# EAGLE design Body-Shield (EAGLE 7.3.0)
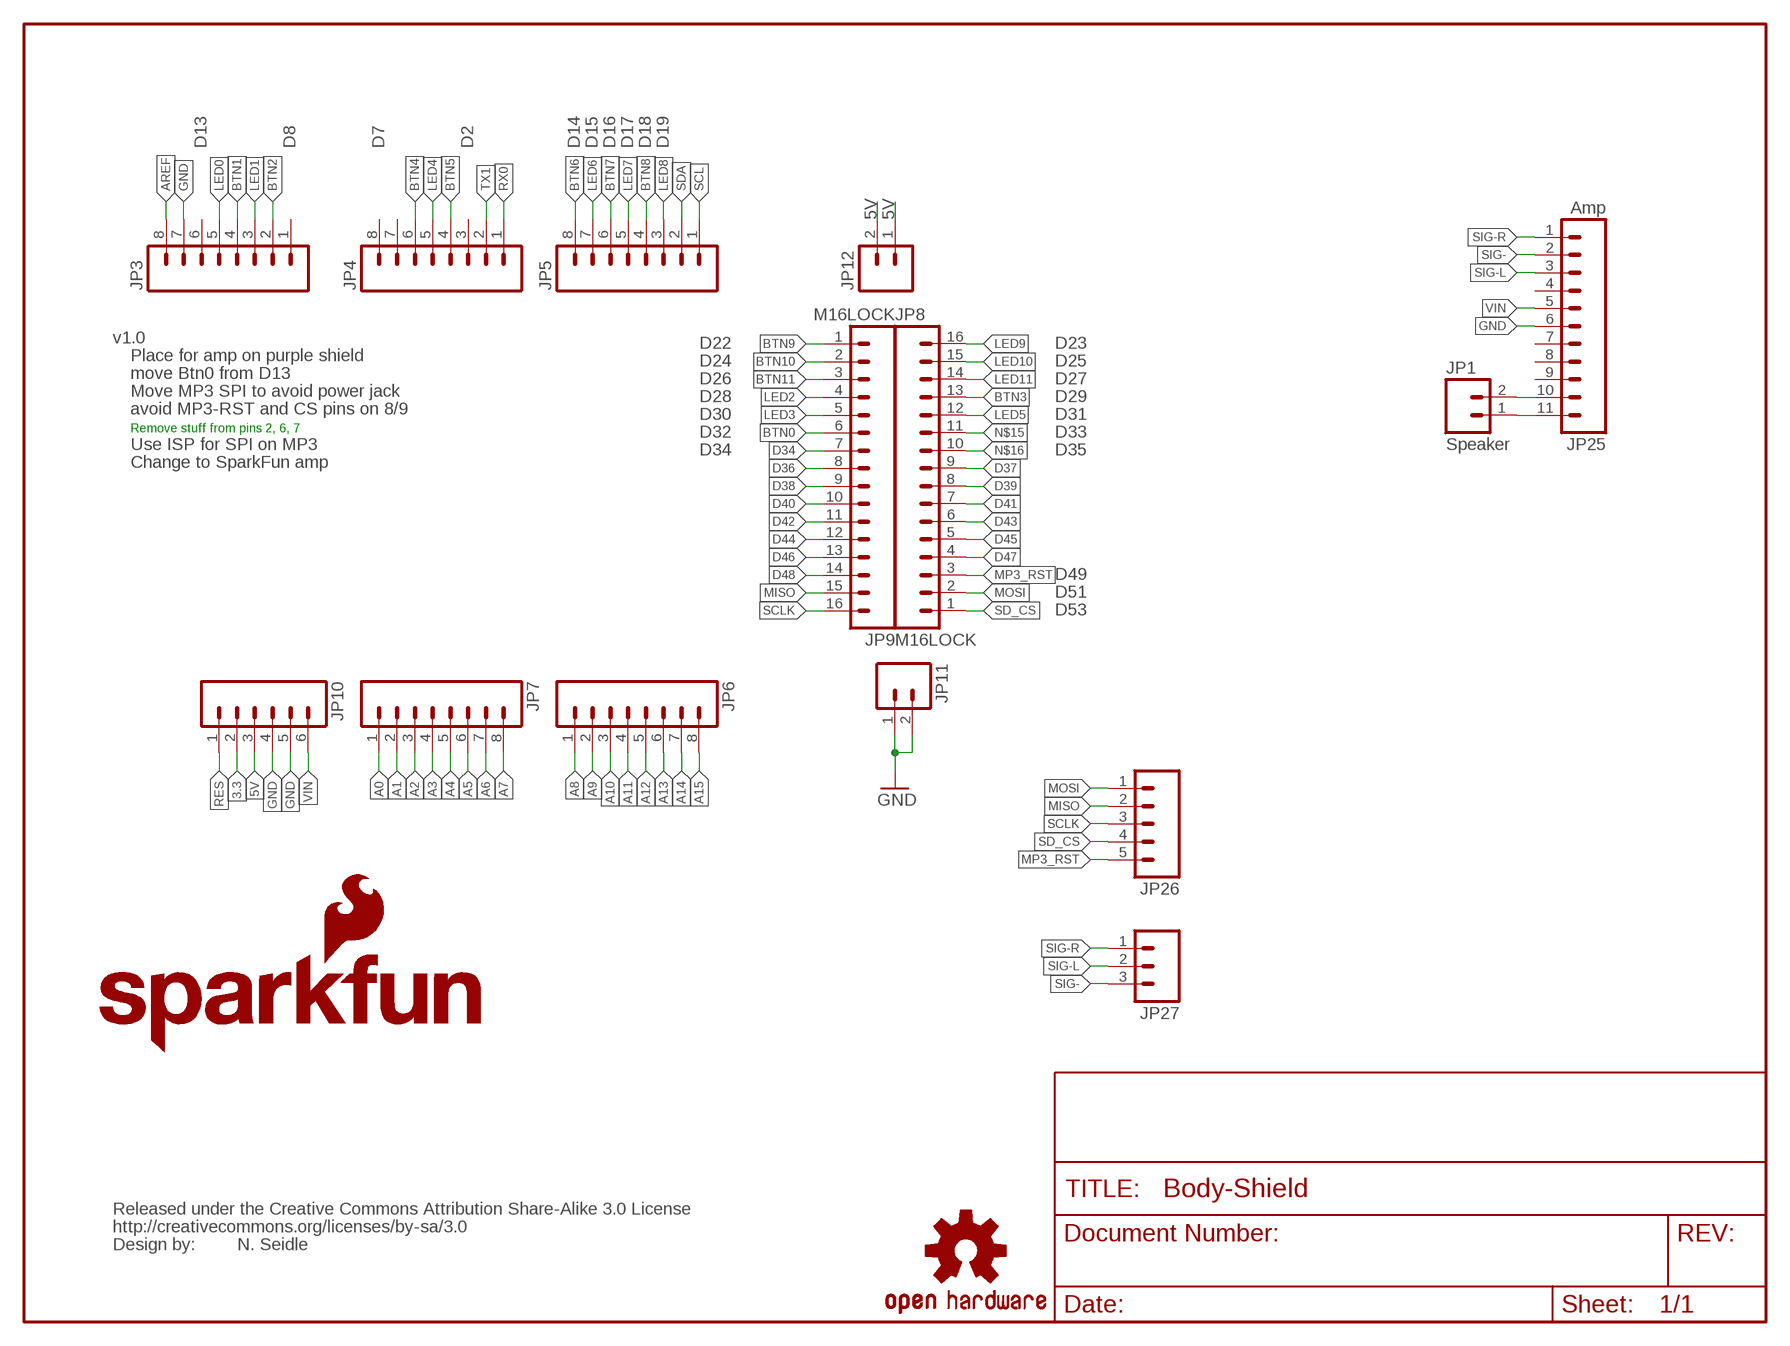
[diagram p0: schematic, sheet 1, part 1 of 2]
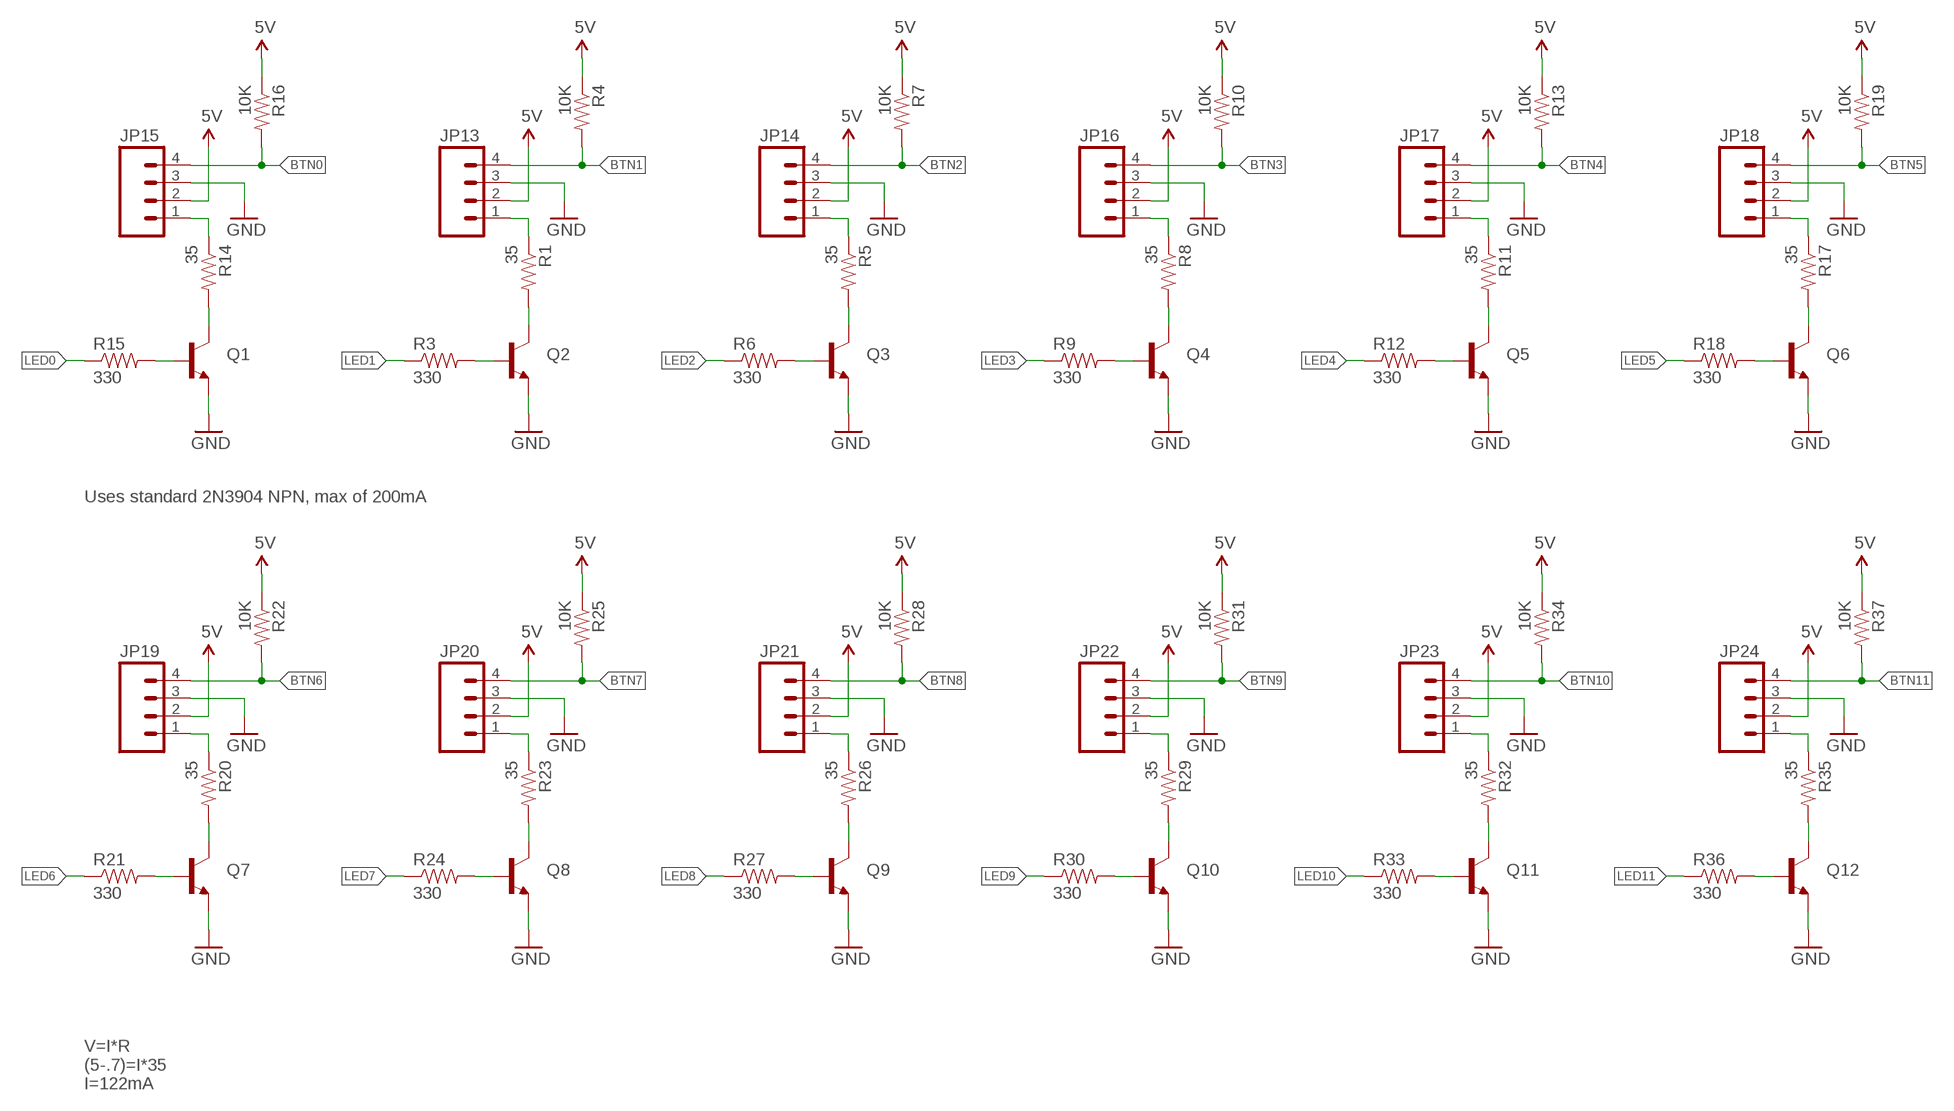
[diagram p1: schematic, sheet 1, part 2 of 2]

## Parts
JP1  Speaker  M02JST-PTH-VERT  [JST-2-PTH-VERT]
JP3  M08LOCK  [1X08_LOCK]
JP4  M08LOCK  [1X08_LOCK]
JP5  M08LOCK  [1X08_LOCK]
JP6  M08LOCK  [1X08_LOCK]
JP7  M08LOCK  [1X08_LOCK]
JP8  M16LOCK  [1X16_LOCK]
JP9  M16LOCK  [1X16_LOCK]
JP10  M06LOCK  [1X06_LOCK]
JP11  M02LOCK  [1X02_LOCK]
JP12  M02LOCK  [1X02_LOCK]
JP13  M04JST-PTH-VERT  [JST-4-PTH-VERT]
JP14  M04JST-PTH-VERT  [JST-4-PTH-VERT]
JP15  M04JST-PTH-VERT  [JST-4-PTH-VERT]
JP16  M04JST-PTH-VERT  [JST-4-PTH-VERT]
JP17  M04JST-PTH-VERT  [JST-4-PTH-VERT]
JP18  M04JST-PTH-VERT  [JST-4-PTH-VERT]
JP19  M04JST-PTH-VERT  [JST-4-PTH-VERT]
JP20  M04JST-PTH-VERT  [JST-4-PTH-VERT]
JP21  M04JST-PTH-VERT  [JST-4-PTH-VERT]
JP22  M04JST-PTH-VERT  [JST-4-PTH-VERT]
JP23  M04JST-PTH-VERT  [JST-4-PTH-VERT]
JP24  M04JST-PTH-VERT  [JST-4-PTH-VERT]
JP25  Amp  M11PTH  [1X11]
JP26  M05JST  [JST-5-PTH]
JP27  M03JST-PTH  [JST-3-PTH]
LOGO1  SFE_LOGO_NAME_FLAME.1_INCH  [SFE_LOGO_NAME_FLAME_.1]
LOGO2  OSHW-LOGOS  [OSHW-LOGO-S]
Q1  TRANSISTOR_NPN2N3904  [TO-92]
Q2  TRANSISTOR_NPN2N3904  [TO-92]
Q3  TRANSISTOR_NPN2N3904  [TO-92]
Q4  TRANSISTOR_NPN2N3904  [TO-92]
Q5  TRANSISTOR_NPN2N3904  [TO-92]
Q6  TRANSISTOR_NPN2N3904  [TO-92]
Q7  TRANSISTOR_NPN2N3904  [TO-92]
Q8  TRANSISTOR_NPN2N3904  [TO-92]
Q9  TRANSISTOR_NPN2N3904  [TO-92]
Q10  TRANSISTOR_NPN2N3904  [TO-92]
Q11  TRANSISTOR_NPN2N3904  [TO-92]
Q12  TRANSISTOR_NPN2N3904  [TO-92]
R1  35  RESISTORPTH1  [AXIAL-0.3]
R3  330  RESISTORPTH1  [AXIAL-0.3]
R4  10K  RESISTORPTH1  [AXIAL-0.3]
R5  35  RESISTORPTH1  [AXIAL-0.3]
R6  330  RESISTORPTH1  [AXIAL-0.3]
R7  10K  RESISTORPTH1  [AXIAL-0.3]
R8  35  RESISTORPTH1  [AXIAL-0.3]
R9  330  RESISTORPTH1  [AXIAL-0.3]
R10  10K  RESISTORPTH1  [AXIAL-0.3]
R11  35  RESISTORPTH1  [AXIAL-0.3]
R12  330  RESISTORPTH1  [AXIAL-0.3]
R13  10K  RESISTORPTH1  [AXIAL-0.3]
R14  35  RESISTORPTH1  [AXIAL-0.3]
R15  330  RESISTORPTH1  [AXIAL-0.3]
R16  10K  RESISTORPTH1  [AXIAL-0.3]
R17  35  RESISTORPTH1  [AXIAL-0.3]
R18  330  RESISTORPTH1  [AXIAL-0.3]
R19  10K  RESISTORPTH1  [AXIAL-0.3]
R20  35  RESISTORPTH1  [AXIAL-0.3]
R21  330  RESISTORPTH1  [AXIAL-0.3]
R22  10K  RESISTORPTH1  [AXIAL-0.3]
R23  35  RESISTORPTH1  [AXIAL-0.3]
R24  330  RESISTORPTH1  [AXIAL-0.3]
R25  10K  RESISTORPTH1  [AXIAL-0.3]
R26  35  RESISTORPTH1  [AXIAL-0.3]
R27  330  RESISTORPTH1  [AXIAL-0.3]
R28  10K  RESISTORPTH1  [AXIAL-0.3]
R29  35  RESISTORPTH1  [AXIAL-0.3]
R30  330  RESISTORPTH1  [AXIAL-0.3]
R31  10K  RESISTORPTH1  [AXIAL-0.3]
R32  35  RESISTORPTH1  [AXIAL-0.3]
R33  330  RESISTORPTH1  [AXIAL-0.3]
R34  10K  RESISTORPTH1  [AXIAL-0.3]
R35  35  RESISTORPTH1  [AXIAL-0.3]
R36  330  RESISTORPTH1  [AXIAL-0.3]
R37  10K  RESISTORPTH1  [AXIAL-0.3]
U$2  CREATIVE_COMMONS  [CREATIVE_COMMONS]

## Nets
3.3: JP10.2
5V: JP10.3 JP12.1 JP12.2 JP13.2 JP14.2 JP15.2 JP16.2 JP17.2 JP18.2 JP19.2 JP20.2 JP21.2 JP22.2 JP23.2 JP24.2 R4.P$1 R7.P$1 R10.P$1 R13.P$1 R16.P$1 R19.P$1 R22.P$1 R25.P$1 R28.P$1 R31.P$1 R34.P$1 R37.P$1
A0: JP7.1
A1: JP7.2
A2: JP7.3
A3: JP7.4
A4: JP7.5
A5: JP7.6
A6: JP7.7
A7: JP7.8
A8: JP6.1
A9: JP6.2
A10: JP6.3
A11: JP6.4
A12: JP6.5
A13: JP6.6
A14: JP6.7
A15: JP6.8
AREF: JP3.8
BTN0: JP9.6 JP15.4 R16.P$2
BTN1: JP3.4 JP13.4 R4.P$2
BTN2: JP3.2 JP14.4 R7.P$2
BTN3: JP8.13 JP16.4 R10.P$2
BTN4: JP4.6 JP17.4 R13.P$2
BTN5: JP4.4 JP18.4 R19.P$2
BTN6: JP5.8 JP19.4 R22.P$2
BTN7: JP5.6 JP20.4 R25.P$2
BTN8: JP5.4 JP21.4 R28.P$2
BTN9: JP9.1 JP22.4 R31.P$2
BTN10: JP9.2 JP23.4 R34.P$2
BTN11: JP9.3 JP24.4 R37.P$2
D34: JP9.7
D36: JP9.8
D37: JP8.9
D38: JP9.9
D39: JP8.8
D40: JP9.10
D41: JP8.7
D42: JP9.11
D43: JP8.6
D44: JP9.12
D45: JP8.5
D46: JP9.13
D47: JP8.4
D48: JP9.14
GND: JP3.7 JP10.4 JP10.5 JP11.1 JP11.2 JP13.3 JP14.3 JP15.3 JP16.3 JP17.3 JP18.3 JP19.3 JP20.3 JP21.3 JP22.3 JP23.3 JP24.3 JP25.6 Q1.1(E) Q2.1(E) Q3.1(E) Q4.1(E) Q5.1(E) Q6.1(E) Q7.1(E) Q8.1(E) Q9.1(E) Q10.1(E) Q11.1(E) Q12.1(E)
LED0: JP3.5 R15.P$1
LED1: JP3.3 R3.P$1
LED2: JP9.4 R6.P$1
LED3: JP9.5 R9.P$1
LED4: JP4.5 R12.P$1
LED5: JP8.12 R18.P$1
LED6: JP5.7 R21.P$1
LED7: JP5.5 R24.P$1
LED8: JP5.3 R27.P$1
LED9: JP8.16 R30.P$1
LED10: JP8.15 R33.P$1
LED11: JP8.14 R36.P$1
MISO: JP9.15 JP26.2
MOSI: JP8.2 JP26.1
MP3_RST: JP8.3 JP26.5
N$1: JP13.1 R1.P$1
N$2: Q2.3(C) R1.P$2
N$3: Q2.2(B) R3.P$2
N$4: JP14.1 R5.P$1
N$5: Q3.3(C) R5.P$2
N$6: Q3.2(B) R6.P$2
N$7: JP16.1 R8.P$1
N$8: JP15.1 R14.P$1
N$9: Q1.3(C) R14.P$2
N$10: Q1.2(B) R15.P$2
N$11: Q4.3(C) R8.P$2
N$12: Q4.2(B) R9.P$2
N$13: JP17.1 R11.P$1
N$15: JP8.11
N$16: JP8.10
N$17: Q5.3(C) R11.P$2
N$18: Q5.2(B) R12.P$2
N$19: JP18.1 R17.P$1
N$20: Q6.3(C) R17.P$2
N$21: Q6.2(B) R18.P$2
N$22: JP19.1 R20.P$1
N$23: Q7.3(C) R20.P$2
N$24: Q7.2(B) R21.P$2
N$25: JP20.1 R23.P$1
N$26: Q8.3(C) R23.P$2
N$27: Q8.2(B) R24.P$2
N$28: JP21.1 R26.P$1
N$29: Q9.3(C) R26.P$2
N$30: Q9.2(B) R27.P$2
N$31: JP22.1 R29.P$1
N$32: Q10.3(C) R29.P$2
N$33: Q10.2(B) R30.P$2
N$34: JP23.1 R32.P$1
N$35: Q11.3(C) R32.P$2
N$36: Q11.2(B) R33.P$2
N$37: JP24.1 R35.P$1
N$38: Q12.3(C) R35.P$2
N$39: Q12.2(B) R36.P$2
N$40: JP1.1 JP25.11
N$41: JP1.2 JP25.10
RES: JP10.1
RX0: JP4.1
SCL: JP5.1
SCLK: JP9.16 JP26.3
SD_CS: JP8.1 JP26.4
SDA: JP5.2
SIG-: JP25.2 JP27.3
SIG-L: JP25.3 JP27.2
SIG-R: JP25.1 JP27.1
TX1: JP4.2
VIN: JP10.6 JP25.5
Unconnected: JP3.1 JP3.6 JP4.3 JP4.7 JP4.8 JP25.4 JP25.7 JP25.8 JP25.9

## Notes on the sheet
- D13 | D8 | D7 | D2 | D14 | D15 | D16 | D17 | D18 | D19
- v1.0
- D22 | D23
- Place for amp on purple shield
- D24 | D25
- move Btn0 from D13
- D26 | D27
- Move MP3 SPI to avoid power jack
- D28 | D29
- avoid MP3-RST and CS pins on 8/9
- D30 | D31
- Remove stuff from pins 2, 6, 7
- D32 | D33
- Use ISP for SPI on MP3
- D34 | D35
- Change to SparkFun amp
- Uses standard 2N3904 NPN, max of 200mA
- D49
- D51
- D53
- V=I*R
  (5-.7)=I*35
  I=122mA
- N. Seidle

## Library data of the parts
JP1 = SparkFun-Connectors:M02: Standard 2-pin 0.1" header. Use with - straight break away headers ( PRT-00116) - right angle break away headers (PRT-00553) - swiss pins (PRT-00743) - machine pins (PRT-00117) - female headers (PRT-00115) Molex polarized connector foot print use with: PRT-08233 with associated crimp pins and housings. 2.54_SCREWTERM for use with PRT-10571. 3.5mm Screw Terminal footprints for PRT-08084 5mm Screw Terminal footprints for use with PRT-08432
JP3-JP7 = SparkFun:M08: Header 8 Standard 8-pin 0.1" header. Use with straight break away headers (SKU : PRT-00116), right angle break away headers (PRT-00553), swiss pins (PRT-00743), machine pins (PRT-00117), and female headers (PRT-00115).
JP8 JP9 = SparkFun:M16
JP10 = SparkFun:M06: Header 6 Standard 6-pin 0.1" header. Use with straight break away headers (SKU : PRT-00116), right angle break away headers (PRT-00553), swiss pins (PRT-00743), machine pins (PRT-00117), and female headers (PRT-00115). Molex polarized connector foot print use with SKU : PRT-08094 with associated crimp pins and housings. NOTES ON THE VARIANTS LOCK and LOCK_LONGPADS... This footprint was designed to help hold the alignment of a through-hole component (i.e. 6-pin header) while soldering it into place. You may notice that each hole has been shifted either up or down by 0.005 of an inch from it's more standard position (which is a perfectly straight line). This slight alteration caused the pins (the squares in the middle) to touch the edges of the holes. Because they are alternating, it causes a "brace" to hold the component in place. 0.005 has proven to be the perfect amount of "off-center" position when using our standard breakaway headers. Although looks a little odd when you look at the bare footprint, once you have a header in there, the alteration is very hard to notice. Also, if you push a header all the way into place, it is covered up entirely on the bottom side. This idea of altering the position of holes to aid alignment will be further integrated into the Sparkfun Library for other footprints. It can help hold any component with 3 or more connection pins.
JP11 JP12 = SparkFun:M02: Header 2 Standard 2-pin 0.1" header. Use with straight break away headers (SKU : PRT-00116), right angle break away headers (PRT-00553), swiss pins (PRT-00743), machine pins (PRT-00117), and female headers (PRT-00115). Molex polarized connector foot print use with SKU : PRT-08233 with associated crimp pins and housings.
JP13-JP24 = SparkFun-Connectors:M04: Header 4 Standard 4-pin 0.1" header. Use with straight break away headers (SKU : PRT-00116), right angle break away headers (PRT-00553), swiss pins (PRT-00743), machine pins (PRT-00117), and female headers (PRT-00115). Molex polarized connector foot print use with SKU : PRT-08231 with associated crimp pins and housings. 1MM SMD Version SKU: PRT-10208
JP25 = SparkFun-Connectors:M11: Header 11 Standard 11-pin 0.1" header. Use with straight break away headers (SKU : PRT-00116), right angle break away headers (PRT-00553), swiss pins (PRT-00743), machine pins (PRT-00117), and female headers (PRT-00115).
JP26 = SparkFun-Connectors:M05: Header 5 Standard 5-pin 0.1" header. Use with straight break away headers (SKU : PRT-00116), right angle break away headers (PRT-00553), swiss pins (PRT-00743), machine pins (PRT-00117), and female headers (PRT-00115). Molex polarized connector foot print use with SKU : PRT-08230 with associated crimp pins and housings.
JP27 = SparkFun-Connectors:M03: Header 3 Standard 3-pin 0.1" header. Use with straight break away headers (SKU : PRT-00116), right angle break away headers (PRT-00553), swiss pins (PRT-00743), machine pins (PRT-00117), and female headers (PRT-00115). Molex polarized connector foot print use with SKU : PRT-08232 with associated crimp pins and housings.; SKU: PRT-09915
LOGO1 = SparkFun-Aesthetics:SFE_LOGO_NAME_FLAME: SFE Logo, name and flame This is the SparkFun full logo. The logo on the schematic will always be the same size; the package variant is the height of the flame part of the logo. Default layer for the logo on the board is tSilk.
LOGO2 = SparkFun-Aesthetics:OSHW-LOGO: Open Source Hardware Logo This logo indicates the piece of hardware it is found on incorporates a OSHW license and/or adheres to the definition of open source hardware found here: http://freedomdefined.org/OSHW
Q1-Q12 = SparkFun-DiscreteSemi:TRANSISTOR_NPN: Generic NPN BJT MMBT2222A - TRANS-08049 (SOT-23, 1A 40V) MPSA42 - TRANS-09116 (SOT-23, 500mA 300V) MMBT5088LT1G - TRANS-11160 (SOT-23, 50 mA 30V) BC547 - COM-08928 <http://www.sparkfun.com/products/8928> (TO-92 45V 100mA) (1.Collector 2.Base 3.Emitter) 2N3904 - COM-00521 <http://www.sparkfun.com/products/521> (TO-92 40V 200mA) (1.Emitter 2.Base 3.Collector) P2N2222A - COM-12852 <http://www.sparkfun.com/products/12852> (TO-92 40V 600mA) (1.Collector 2.Base 3.Emitter); PROD_ID: TRANS-08447
R1 R3-R37 = SparkFun:RESISTOR: Resistor Basic schematic elements and footprints for 0603, 1206, and PTH 1/10th watt (small) resistors.
U$2 = SparkFun:CREATIVE_COMMONS

## Board
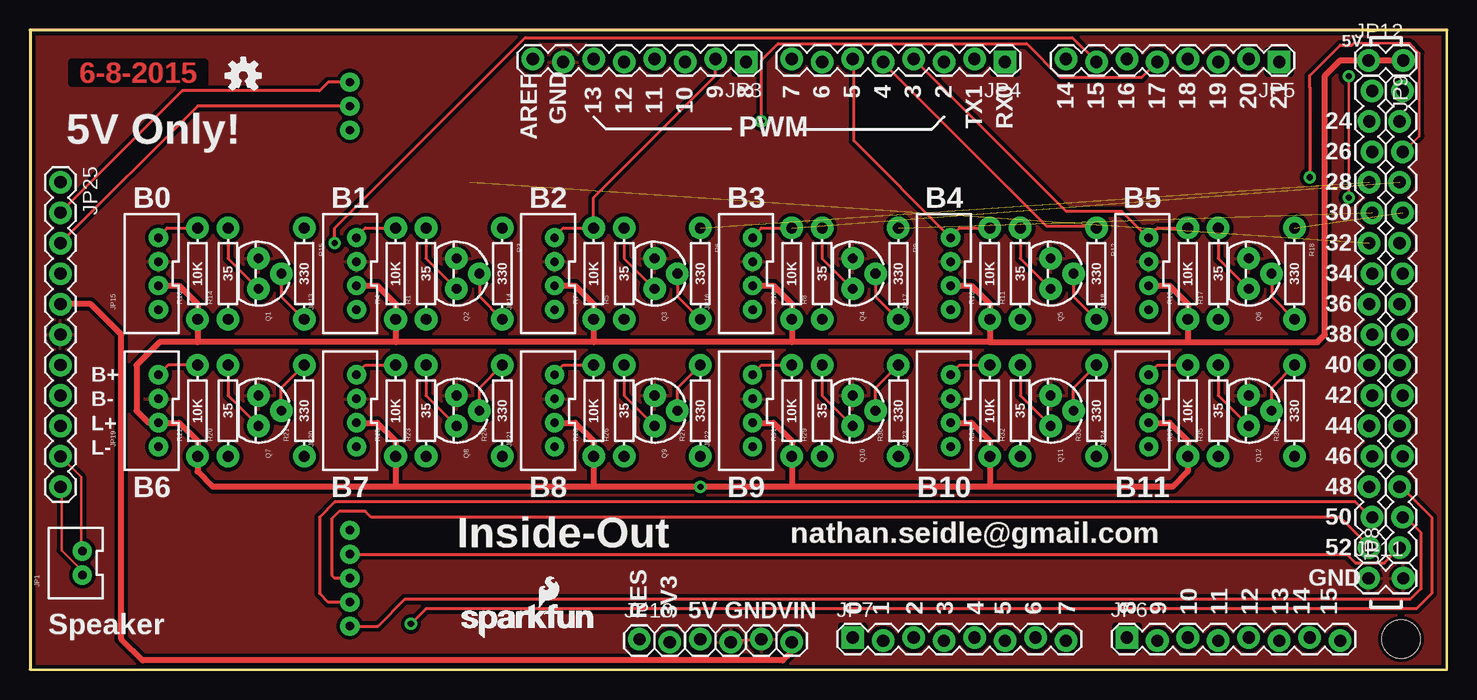
[diagram p2: board, top side]
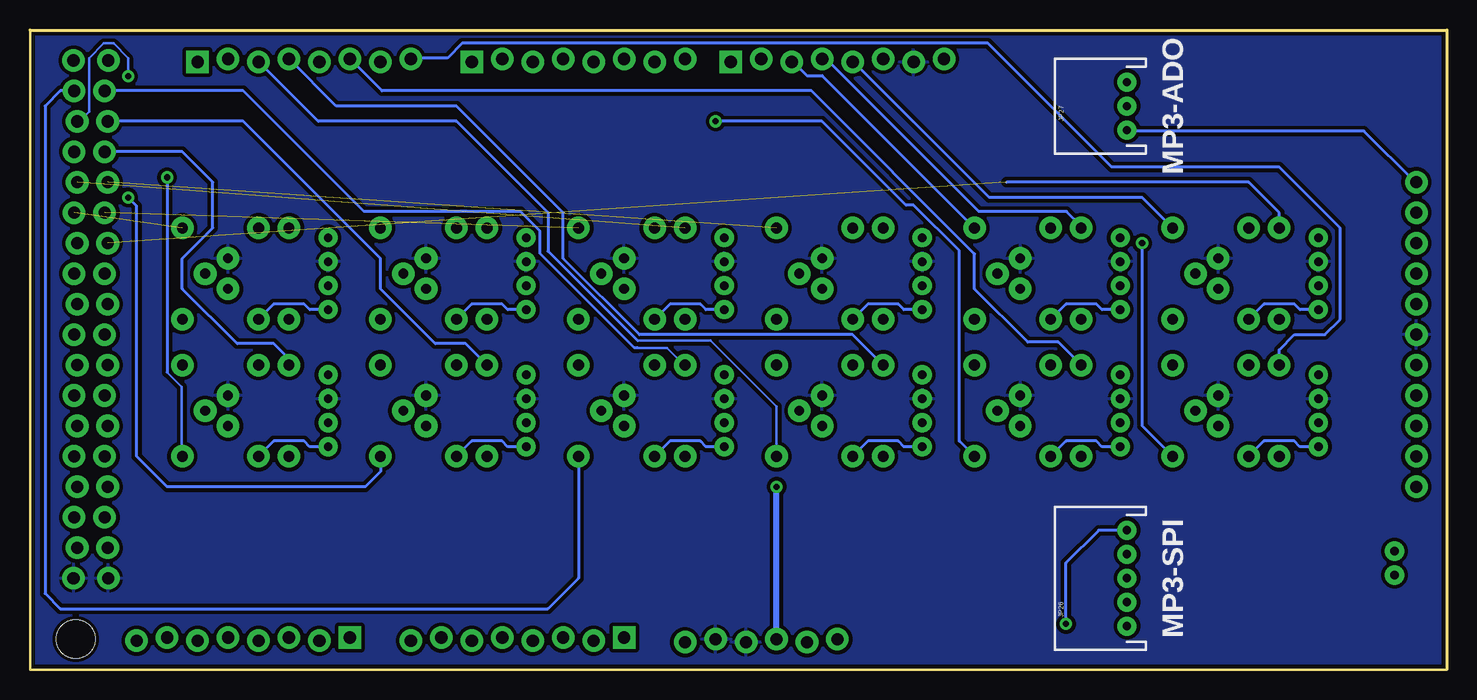
[diagram p3: board, bottom side, seen from below]

Size 118.11 x 53.34 mm. Coordinates in mm from the lower left corner, seen from the top.
Outline: 0,0 118.11,0 118.11,53.34 0,53.34 0,0
Copper layers (1*16): Top 0.035mm / dielectric 1.5mm / Bottom 0.035mm
Design rules "default": minimum track width 8mil, minimum drill 20mil, track to track 8mil, track to pad 8mil, pad to pad 8mil, via to via 8mil, smd to smd 8mil, copper to edge 10mil, drill to drill 8mil, minimum pad ring 12mil, minimum via ring 10mil, stop-mask expansion 4mil, vias tented up to drill 25mil, thermal gap 10mil
Holes 3.2 mm at 114.3,2.54

### Footprints (pad centres in the part's own frame; a part is rotated, then mirrored left to right if it is on the bottom)
JST-2-PTH-VERT = drill 0.7 pad 1.6: 1 -1,-0.55; 2 1,-0.55
1X08_LOCK = drill 1.016 pad 1.88 square: 1 0,0.127 | drill 1.016 pad 1.88: 2 2.54,-0.127; 3 5.08,0.127; 4 7.62,-0.127; 5 10.16,0.127; 6 12.7,-0.127; 7 15.24,0.127; 8 17.78,-0.127
1X16_LOCK = drill 1.016 pad 1.88: 1 0,0.127; 2 2.54,-0.127; 3 5.08,0.127; 4 7.62,-0.127; 5 10.16,0.127; 6 12.7,-0.127; 7 15.24,0.127; 8 17.78,-0.127; 9 20.32,0.127; 10 22.86,-0.127; 11 25.4,0.127; 12 27.94,-0.127; 13 30.48,0.127; 14 33.02,-0.127; 15 35.56,0.127; 16 38.1,-0.127
1X06_LOCK = drill 1.016 pad 1.88: 1 0,0; 2 2.54,-0.254; 3 5.08,0; 4 7.62,-0.254; 5 10.16,0; 6 12.7,-0.254
1X02_LOCK = drill 1.016 pad 1.88: 1 -0.178,0; 2 2.718,0
JST-4-PTH-VERT = drill 0.7 pad 1.6: 1 -3,-0.55; 2 -1,-0.55; 3 1,-0.55; 4 3,-0.55
1X11 = drill 1.016 pad 1.88: 1 0,0; 2 2.54,0; 3 5.08,0; 4 7.62,0; 5 10.16,0; 6 12.7,0; 7 15.24,0; 8 17.78,0; 9 20.32,0; 10 22.86,0; 11 25.4,0
JST-5-PTH = drill 0.7 pad 1.6: 1 -4,0; 2 -2,0; 3 0,0; 4 2,0; 5 4,0
JST-3-PTH = drill 0.7 pad 1.6: 1 -2,0; 2 0,0; 3 2,0
TO-92 = drill 0.813 pad 1.88: 1 -1.27,0; 2 0,1.905; 3 1.27,0
AXIAL-0.3 = drill 0.9 pad 1.88: P$1 -3.81,0; P$2 3.81,0

### Placement (x,y rotation side)
JP1  3.81,8.89 90 top
JP3  59.69,50.8 180 top
JP4  81.28,50.8 180 top
JP5  104.14,50.8 180 top
JP6  91.44,2.54 0 top
JP7  68.58,2.54 0 top
JP8  114.3,10.16 90 top
JP9  111.76,48.26 270 top
JP10  50.8,2.54 0 top
JP11  111.76,7.62 0 top
JP12  111.76,50.8 0 top
JP13  26.67,33.02 90 top
JP14  43.18,33.02 90 top
JP15  10.16,33.02 90 top
JP16  59.69,33.02 90 top
JP17  76.2,33.02 90 top
JP18  92.71,33.02 90 top
JP19  10.16,21.59 90 top
JP20  26.67,21.59 90 top
JP21  43.18,21.59 90 top
JP22  59.69,21.59 90 top
JP23  76.2,21.59 90 top
JP24  92.71,21.59 90 top
JP25  2.54,40.64 270 top
JP26  26.67,7.62 90 bottom
JP27  26.67,46.99 90 bottom
LOGO1  35.56,2.54 0 top
LOGO2  17.78,49.53 0 top
Q1  19.05,33.02 270 top
Q2  35.56,33.02 270 top
Q3  52.07,33.02 270 top
Q4  68.58,33.02 270 top
Q5  85.09,33.02 270 top
Q6  101.6,33.02 270 top
Q7  19.05,21.59 270 top
Q8  35.56,21.59 270 top
Q9  52.07,21.59 270 top
Q10  68.58,21.59 270 top
Q11  85.09,21.59 270 top
Q12  101.6,21.59 270 top
R1  33.02,33.02 90 top
R3  39.37,33.02 270 top
R4  30.48,33.02 90 top
R5  49.53,33.02 90 top
R6  55.88,33.02 270 top
R7  46.99,33.02 90 top
R8  66.04,33.02 90 top
R9  72.39,33.02 270 top
R10  63.5,33.02 90 top
R11  82.55,33.02 90 top
R12  88.9,33.02 270 top
R13  80.01,33.02 90 top
R14  16.51,33.02 90 top
R15  22.86,33.02 270 top
R16  13.97,33.02 90 top
R17  99.06,33.02 90 top
R18  105.41,33.02 270 top
R19  96.52,33.02 90 top
R20  16.51,21.59 90 top
R21  22.86,21.59 90 top
R22  13.97,21.59 90 top
R23  33.02,21.59 90 top
R24  39.37,21.59 90 top
R25  30.48,21.59 90 top
R26  49.53,21.59 90 top
R27  55.88,21.59 90 top
R28  46.99,21.59 90 top
R29  66.04,21.59 90 top
R30  72.39,21.59 90 top
R31  63.5,21.59 90 top
R32  82.55,21.59 90 top
R33  88.9,21.59 90 top
R34  80.01,21.59 90 top
R35  99.06,21.59 90 top
R36  105.41,21.59 90 top
R37  96.52,21.59 90 top
U$2  25.4,-12.7 0 top  (outside the outline)

### Tracks (layer width: path | path; a pad name or v marks a point on that pad's centre or on a via)
5V  (via drill 0.51)
  Top 0.508: 80.01,27.3 63.5,27.3 | 63.5,27.3 46.99,27.3 | 46.99,27.3 30.48,27.3 | 30.48,27.3 13.97,27.3 | 13.97,27.3 R16.P$1 13.97,30.48 12.43,32.02 JP15.2 | 30.48,27.3 R4.P$1 30.48,30.48 28.94,32.02 JP13.2 | 46.99,27.3 R7.P$1 46.99,30.48 45.45,32.02 JP14.2 | 63.5,27.3 R10.P$1 63.5,30.48 61.96,32.02 JP16.2 | 80.01,27.3 R13.P$1 80.01,30.48 78.47,32.02 JP17.2 | 80.01,27.3 96.52,27.3 | 96.52,27.3 107.31,27.3 107.95,27.94 107.95,49.53 109.22,50.8 JP12.1 JP12.2 | 96.52,27.3 R19.P$1 96.52,30.48 94.98,32.02 JP18.2 | 13.97,27.3 10.79,27.3 8.89,25.4 8.89,21.59 9.89,20.59 JP19.2 12.43,20.59 13.97,19.05 R22.P$1 13.97,16.51 15.24,15.24 30.48,15.24 | JP20.2 28.94,20.59 30.48,19.05 R25.P$1 30.48,15.24 | JP21.2 45.45,20.59 46.99,19.05 R28.P$1 46.99,15.24 | JP22.2 61.96,20.59 63.5,19.05 R31.P$1 63.5,15.24 | JP23.2 78.47,20.59 80.01,19.05 R34.P$1 80.01,15.24 | JP24.2 94.98,20.59 96.52,19.05 R37.P$1 96.52,16.51 95.25,15.24 80.01,15.24 | 80.01,15.24 63.5,15.24 | 63.5,15.24 v55.88,15.24 46.99,15.24 | 46.99,15.24 30.48,15.24
  Bottom 0.203: 13.82,17.88 R22.P$1
  Bottom 0.508: JP10.3 v55.88,15.24
BTN0  (1 unrouted)
  Top 0.254: JP15.4 10.71,36.11 11.43,36.83 R16.P$2
  Bottom 0.254: R16.P$2 13.97,38.1 16.51,40.64 36.7,40.64
BTN1
  Top 0.254: JP13.4 27.22,36.11 27.94,36.83 R4.P$2
  Bottom 0.254: JP3.4 52.02,50.8 51.61,50.8 39.01,38.2 31.7,38.2 30.48,36.98 R4.P$2
BTN2
  Top 0.254: JP14.4 43.73,36.11 44.45,36.83 R7.P$2 46.99,39.37 57.15,49.53 JP3.2
BTN3  (1 unrouted)
  Top 0.254: JP16.4 60.24,36.11 60.96,36.83 R10.P$2
BTN4
  Top 0.254: JP4.6 68.68,50.8 68.68,44.09 76.61,36.17 JP17.4 76.75,36.11 77.47,36.83 R13.P$2
BTN5
  Top 0.254: R19.P$2 93.98,36.83 93.26,36.11 JP18.4 93.07,36.17 91.03,38.2 86.38,38.2 JP4.4
BTN6
  Top 0.254: 10.71,24.68 JP19.4 11.52,25.4 R22.P$2
  Bottom 0.254: JP5.8 86.36,51 83.31,51 82.09,52.22 38.25,52.22 27.94,41.91 13.97,41.91 8.89,36.83 8.89,29.21 10.16,27.94 12.7,27.94 13.97,26.67 R22.P$2
BTN7
  Top 0.254: JP20.4 27.22,24.68 27.94,25.4 R25.P$2
  Bottom 0.254: R25.P$2 32.38,27.3 34.92,27.3 39.37,31.75 39.37,34.67 52.96,48.26 88.77,48.26 JP5.6
BTN8
  Top 0.254: JP21.4 43.73,24.68 44.45,25.4 R28.P$2
  Bottom 0.254: R28.P$2 49.53,27.94 67.31,27.94 73.66,34.29 73.66,38.1 82.55,46.99 92.58,46.99 JP5.4
BTN9
  Top 0.254: JP22.4 60.24,24.68 60.96,25.4 R31.P$2
  Bottom 0.203: 67.46,26.82 65.02,26.82 63.6,25.4 R31.P$2 | 111.76,48.16 JP9.1
  Bottom 0.254: JP9.1 100.33,48.26 90.27,38.2 77.22,38.2 75.59,36.58 75.59,34.7 67.72,26.82 67.46,26.82
BTN10
  Top 0.254: JP23.4 76.75,24.68 77.47,25.4 R34.P$2
  Bottom 0.254: R34.P$2 81.79,27.18 84.33,27.18 88.9,31.75 88.9,34.29 100.33,45.72 JP9.2
BTN11
  Top 0.254: JP24.4 93.26,24.68 93.98,25.4 R37.P$2
  Bottom 0.254: R37.P$2 96.52,25.91 97.79,27.18 100.84,27.18 105.41,31.75 105.41,34.29 102.87,36.83 102.87,40.64 105.41,43.18 JP9.3
GND
  Top 0.203: JP10.4 58.52,2.44 60.96,2.44 JP10.5
  Bottom 0.203: 60.35,22.76 JP22.3
  pour Bottom (isolate 0.305): 0,0 118.11,0 118.11,53.34 0,53.34
  pour Top (isolate 0.305): 0,0 118.11,0 118.11,53.34 0,53.34
LED0
  Bottom 0.254: JP3.5 49.38,50.6 38.15,39.37 25.4,39.37 R15.P$1
LED1
  Bottom 0.254: R3.P$1 52.07,49.53 53.34,49.53 54.48,50.67 JP3.3
LED2  (1 unrouted)
LED3  (1 unrouted)
LED4
  Top 0.254: R12.P$1 88.8,36.98 84.73,36.98 71.12,50.6 JP4.5
LED5  (1 unrouted)
LED6  (via drill 0.51)
  Top 0.254: JP5.7 88.8,50.8 86.89,52.7 41.27,52.7 25.4,36.83 v25.4,35.56
  Bottom 0.254: v25.4,35.56 25.4,20.32 R21.P$1
LED7  (via drill 0.51)
  Top 0.254: JP5.5 93.88,50.6 92.66,49.38 85.9,49.38 83.08,52.2 62.36,52.2 60.96,50.8 v60.96,45.72
  Bottom 0.254: v60.96,45.72 52.07,45.72 45.09,38.73 44.45,38.73 40.64,34.92 40.64,19.05 R24.P$1
LED8
  Bottom 0.203: R27.P$1 55.88,21.95 61.37,27.43 67.46,27.43
  Bottom 0.254: JP5.3 98.96,50.6 94.08,45.72 82.55,45.72 74.93,38.1 74.93,34.9 67.46,27.43
LED9
  Bottom 0.254: JP8.16 115.57,48.26 116.84,46.99 116.84,6.35 115.57,5.08 74.93,5.08 72.39,7.62 R30.P$1
LED10  (via drill 0.51)
  Top 0.203: v109.93,49.48 v109.93,39.37
  Bottom 0.203: v109.93,49.48 109.93,51 111.15,52.22 111.96,52.22 113.18,51 113.18,46.53 114,45.72 JP8.15
  Bottom 0.254: R33.P$1 88.9,16.51 90.17,15.24 106.68,15.24 109.22,17.78 109.22,38.66 v109.93,39.37
LED11  (via drill 0.51)
  Top 0.203: 110.34,52.22 115.01,52.22 115.82,51.41 115.82,44.5 114.6,43.28 JP8.14
  Top 0.254: v106.68,41.05 106.68,48.56 106.68,49.53 109.22,52.07 110.19,52.07 110.34,52.22
  Bottom 0.203: 106.68,24.79 105.46,23.57 105.46,17.88 R36.P$1
  Bottom 0.254: v106.68,41.05 106.68,24.79
MISO
  Top 0.254: JP9.15 111.76,12.7 110.49,13.97 25.4,13.97 24.13,12.7 24.13,6.35 24.86,5.62 JP26.2
MOSI
  Top 0.254: JP8.2 114.68,12.7 115.95,11.43 115.95,6.73 115.06,5.84 31.24,5.84 29.02,3.62 JP26.1
MP3_RST  (via drill 0.51)
  Top 0.254: JP8.3 114.3,15.24 116.84,12.7 116.84,6.35 115.57,5.08 33.02,5.08 v31.75,3.81
  Bottom 0.254: v31.75,3.81 31.75,8.89 29.02,11.62 JP26.5
N$1
  Bottom 0.254: JP13.1 28.75,30.02 29.21,30.48 31.75,30.48 R1.P$1
N$2
  Top 0.254: R1.P$2 33.02,34.29 Q2.3
N$3
  Top 0.254: Q2.2 37.47,31.11 R3.P$2
N$4
  Bottom 0.254: JP14.1 45.26,30.02 45.72,30.48 48.26,30.48 R5.P$1
N$5
  Top 0.254: R5.P$2 49.53,34.29 Q3.3
N$6
  Top 0.254: Q3.2 53.98,31.11 R6.P$2
N$7
  Bottom 0.254: JP16.1 61.77,30.02 62.23,30.48 64.77,30.48 R8.P$1
N$8
  Bottom 0.254: JP15.1 12.24,30.02 12.7,30.48 15.24,30.48 R14.P$1
N$9
  Top 0.254: R14.P$2 16.51,34.29 Q1.3
N$10
  Top 0.254: Q1.2 20.96,31.11 R15.P$2
N$11
  Top 0.254: R8.P$2 66.04,34.29 Q4.3
N$12
  Top 0.254: Q4.2 70.48,31.11 R9.P$2
N$13
  Bottom 0.254: JP17.1 78.28,30.02 78.74,30.48 81.28,30.48 R11.P$1
N$17
  Top 0.254: R11.P$2 82.55,34.29 Q5.3
N$18
  Top 0.254: Q5.2 87,31.11 R12.P$2
N$19
  Bottom 0.254: JP18.1 94.79,30.02 95.25,30.48 97.79,30.48 R17.P$1
N$20
  Top 0.254: R17.P$2 99.06,34.29 Q6.3
N$21
  Top 0.254: Q6.2 103.5,31.11 R18.P$2
N$22
  Bottom 0.254: JP19.1 12.24,18.59 12.7,19.05 15.24,19.05 R20.P$1
N$23
  Top 0.254: R20.P$2 16.51,22.86 Q7.3
N$24
  Top 0.254: Q7.2 20.96,23.5 R21.P$2
N$25
  Bottom 0.254: JP20.1 28.75,18.59 29.21,19.05 31.75,19.05 R23.P$1
N$26
  Top 0.254: R23.P$2 33.02,22.86 Q8.3
N$27
  Top 0.254: Q8.2 37.47,23.5 R24.P$2
N$28
  Bottom 0.254: JP21.1 45.26,18.59 45.72,19.05 48.26,19.05 R26.P$1
N$29
  Top 0.254: R26.P$2 49.53,22.86 Q9.3
N$30
  Top 0.254: Q9.2 53.98,23.5 R27.P$2
N$31
  Bottom 0.254: JP22.1 61.77,18.59 62.23,19.05 64.77,19.05 R29.P$1
N$32
  Top 0.254: R29.P$2 66.04,22.86 Q10.3
N$33
  Top 0.254: Q10.2 70.48,23.5 R30.P$2
N$34
  Bottom 0.254: JP23.1 78.28,18.59 78.74,19.05 81.28,19.05 R32.P$1
N$35
  Top 0.254: R32.P$2 82.55,22.86 Q11.3
N$36
  Top 0.254: Q11.2 87,23.5 R33.P$2
N$37
  Bottom 0.254: JP24.1 94.79,18.59 95.25,19.05 97.79,19.05 R35.P$1
N$38
  Top 0.254: R35.P$2 99.06,22.86 Q12.3
N$39
  Top 0.254: Q12.2 103.5,23.5 R36.P$2
N$40
  Top 0.203: JP1.1 4.27,7.92 4.27,8.33 2.64,9.96 2.64,15.24 JP25.11
N$41
  Top 0.203: JP25.10 4.27,16.05 4.27,9.96 JP1.2
SCLK
  Top 0.254: JP9.16 111.63,10.29 109.22,12.7 28.45,12.7 27.94,13.21 25.78,13.21 25.15,12.57 25.15,7.87 25.4,7.62 JP26.3
SD_CS
  Top 0.254: JP26.4 109.76,9.62 110.49,8.89 112.9,8.89 JP8.1
SIG-
  Top 0.254: JP27.3 24.86,48.99 24.13,48.26 12.7,48.26 JP25.2
SIG-L
  Top 0.254: JP27.2 13.97,46.99 JP25.3
SIG-R
  Bottom 0.254: JP27.1 26.62,44.91 6.91,44.91 2.64,40.64 JP25.1
VIN
  Top 0.203: 63.4,2.23 JP10.6
  Top 0.508: 63.4,2.23 63.4,1.42 62.74,0.76 9.4,0.76 7.62,2.54 7.62,27.94 5.08,30.48 JP25.5

### Text on the board
Top: 6-8-2015
tPlace: 5V | 9 | 8 | 7 | 6 | 5 | 4 | 3 | 2 | 1 | 0 | 14 | 15 | 16 | 17 | 18 | 19 | 20 | 21 | 13 | 12 | 11 | 10 | 5V Only! | GND | TX | RX | 24 | AREF | PWM | 26 | 28 | B0 | B1 | B2 | B3 | B4 | B5 | 30 | 32 | 34 | 36 | 38 | 40 | B+ | B- | 42 | L+ | 44 | L- | 46 | B6 | B7 | B8 | B9 | B10 | B11 | 48 | 50 | Inside-Out | nathan.seidle@gmail.com | 52 | GND | 0 | 1 | 2 | 3 | 4 | 5 | 6 | 7 | 8 | 9 | 10 | 11 | 12 | 13 | 14 | 15 | Speaker | RES | 3V3 | 5V | GND | VIN
bPlace: MP3-ADO | MP3-SPI